# EAGLE schematic H05-dl (EAGLE 6.6.0)

## Sheet 1 of 3
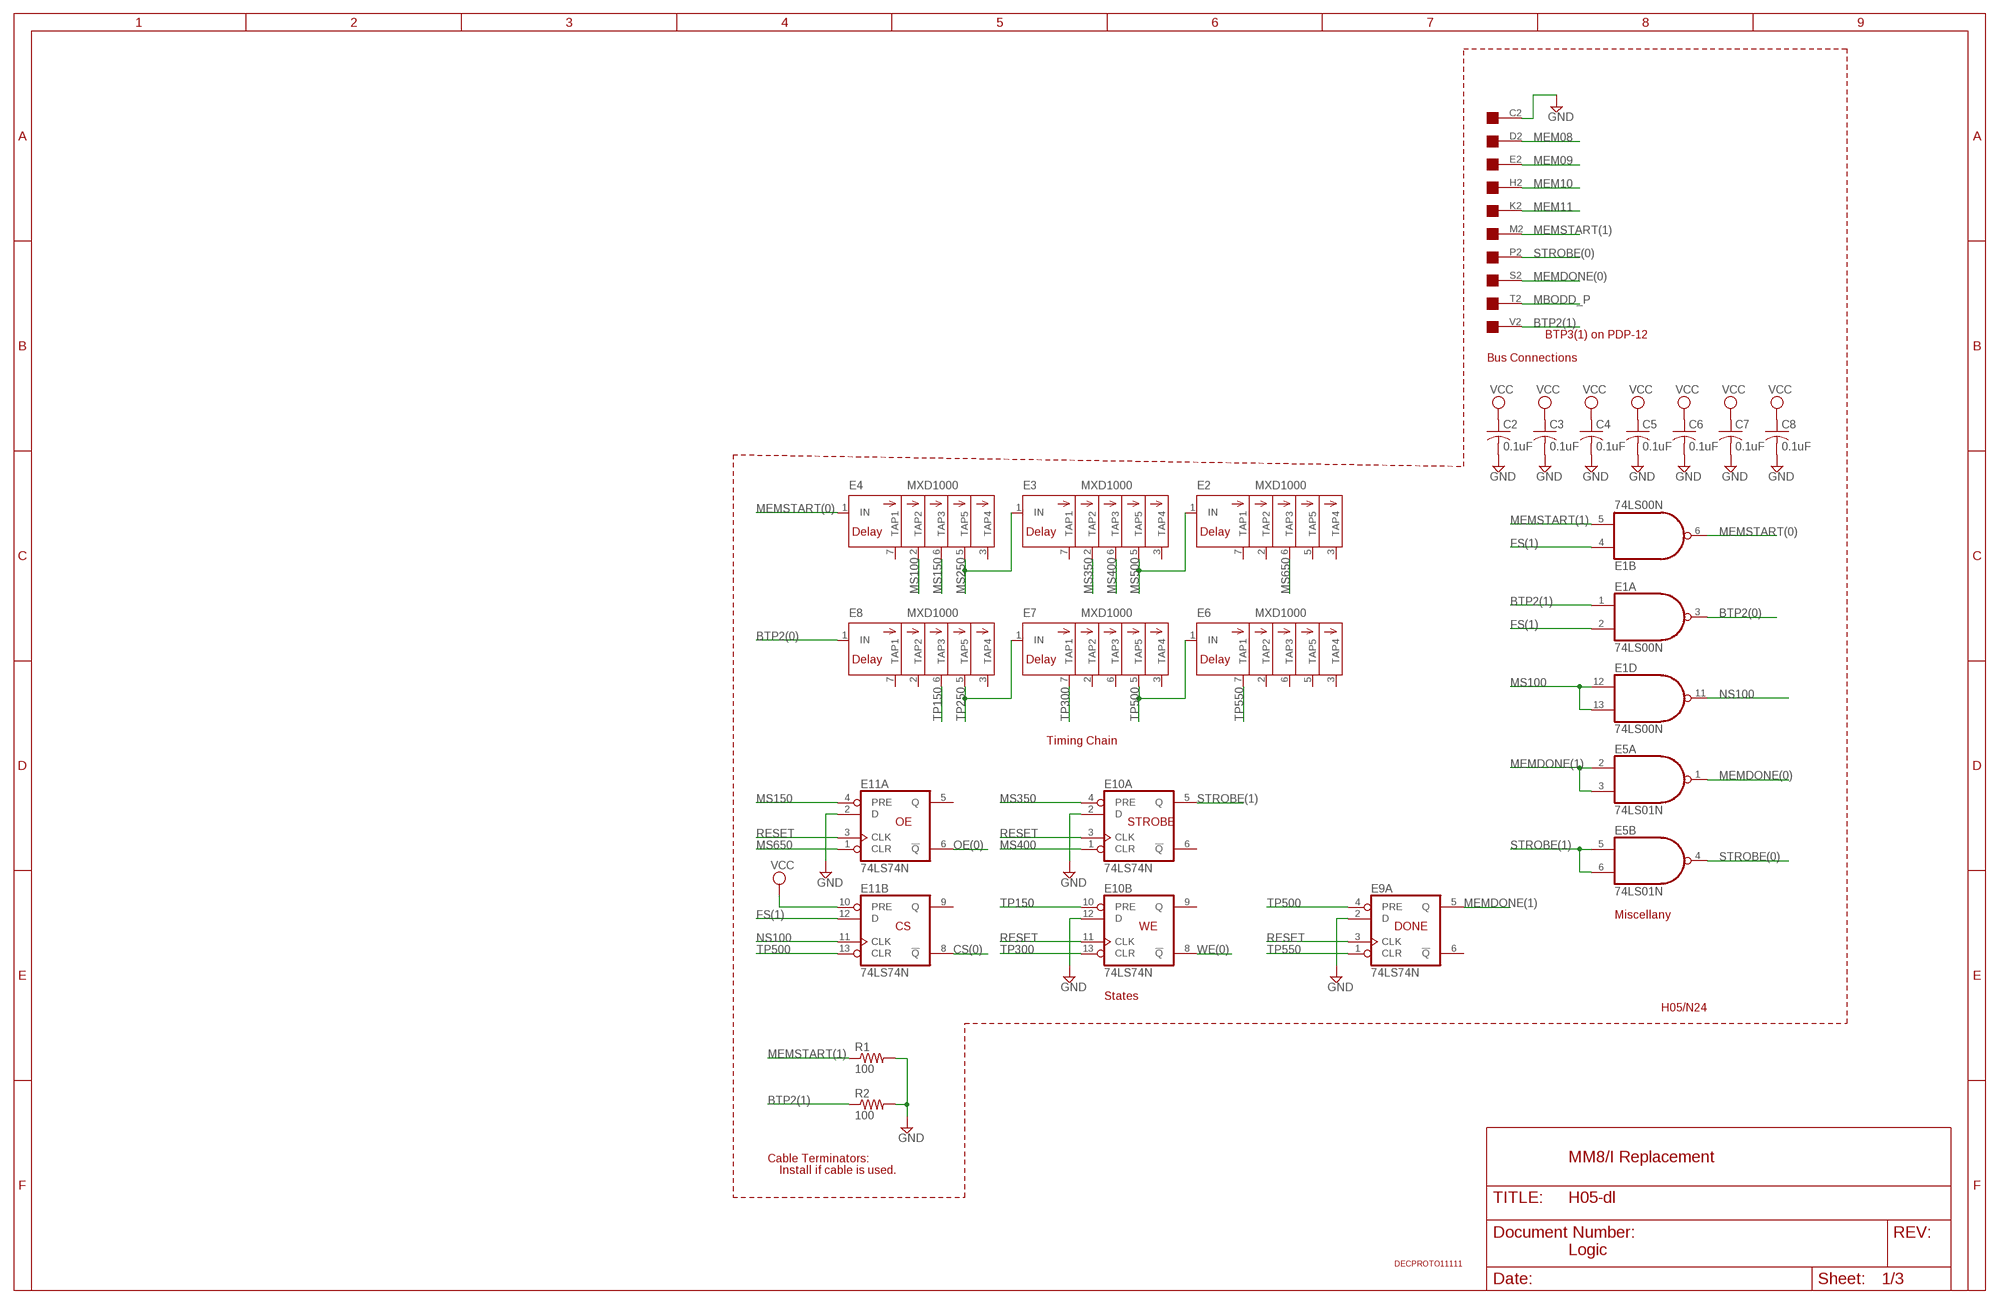
[diagram p0: schematic, sheet 1]

### Parts
C2  0.1uF  C-US050-025X075  [C050-025X075]
C3  0.1uF  C-US050-025X075  [C050-025X075]
C4  0.1uF  C-US050-025X075  [C050-025X075]
C5  0.1uF  C-US050-025X075  [C050-025X075]
C6  0.1uF  C-US050-025X075  [C050-025X075]
C7  0.1uF  C-US050-025X075  [C050-025X075]
C8  0.1uF  C-US050-025X075  [C050-025X075]
E1  74LS00N  [DIL14]
E2  MXD1000  [DIL08]
E3  MXD1000  [DIL08]
E4  MXD1000  [DIL08]
E5  74LS01N  [DIL14]
E6  MXD1000  [DIL08]
E7  MXD1000  [DIL08]
E8  MXD1000  [DIL08]
E9  74LS74N  [DIL14]
E10  74LS74N  [DIL14]
E11  74LS74N  [DIL14]
H05  EDGE-1  [EDGE-CON1]
R1  100  R-US_0207/10  [0207/10]
R2  100  R-US_0207/10  [0207/10]
U$6  DECPROTO11111  [DECPROTO11111]

### Nets
BTP2(0): E1.3(A:O) E8.1(IN)
BTP2(1): E1.1(A:I0) H05.V2 R2.1
CS(0): E11.8(B:!Q) ; also sheet 2
FS(1): E1.2(A:I1) E1.4(B:I0) E11.12(B:D) ; also sheet 2
GND [supply]: C2.2 C3.2 C4.2 C5.2 C6.2 C7.2 C8.2 E9.2(A:D) E10.2(A:D) E10.12(B:D) E11.2(A:D) H05.C2 R1.2 R2.2 ; also sheet 2
MBODD_P: H05.T2 ; also sheet 2
MEM08: H05.D2 ; also sheet 2
MEM09: H05.E2 ; also sheet 2
MEM10: H05.H2 ; also sheet 2
MEM11: H05.K2 ; also sheet 2
MEMDONE(0): E5.1(A:O) H05.S2
MEMDONE(1): E5.2(A:I0) E5.3(A:I1) E9.5(A:Q)
MEMSTART(0): E1.6(B:O) E4.1(IN) ; also sheet 2
MEMSTART(1): E1.5(B:I1) H05.M2 R1.1
MS100: E1.12(D:I0) E1.13(D:I1) E4.2(TAP2)
MS150: E4.6(TAP3) E11.4(A:PRE)
MS250: E3.1(IN) E4.5(TAP5)
MS350: E3.2(TAP2) E10.4(A:PRE)
MS400: E3.6(TAP3) E10.1(A:CLR)
MS500: E2.1(IN) E3.5(TAP5)
MS650: E2.6(TAP3) E11.1(A:CLR)
NS100: E1.11(D:O) E11.11(B:CLK)
OE(0): E11.6(A:!Q) ; also sheet 2
RESET: E9.3(A:CLK) E10.3(A:CLK) E10.11(B:CLK) E11.3(A:CLK) ; also sheet 2
STROBE(0): E5.4(B:O) H05.P2
STROBE(1): E5.5(B:I0) E5.6(B:I1) E10.5(A:Q)
TP150: E8.6(TAP3) E10.10(B:PRE)
TP250: E7.1(IN) E8.5(TAP5)
TP300: E7.7(TAP1) E10.13(B:CLR)
TP500: E6.1(IN) E7.5(TAP5) E9.4(A:PRE) E11.13(B:CLR)
TP550: E6.7(TAP1) E9.1(A:CLR)
VCC [supply]: C2.1 C3.1 C4.1 C5.1 C6.1 C7.1 C8.1 E11.10(B:PRE) ; also sheet 2
WE(0): E10.8(B:!Q) ; also sheet 2
Unconnected: E2.2(TAP2) E2.3(TAP4) E2.5(TAP5) E2.7(TAP1) E3.3(TAP4) E3.7(TAP1) E4.3(TAP4) E4.7(TAP1) E6.2(TAP2) E6.3(TAP4) E6.5(TAP5) E6.6(TAP3) E7.2(TAP2) E7.3(TAP4) E7.6(TAP3) E8.2(TAP2) E8.3(TAP4) E8.7(TAP1) E9.6(A:!Q) E10.6(A:!Q) E10.9(B:Q) E11.5(A:Q) E11.9(B:Q) H05.A2 H05.B2 H05.F2 H05.J2 H05.L2 H05.N2 H05.R2 H05.U2

### Notes on the sheet
- BTP3(1) on PDP-12
- Bus Connections
- Timing Chain
- OE | STROBE
- Miscellany
- CS | WE | DONE
- States
- H05/N24
- Cable Terminators: | MM8/I Replacement
- Install if cable is used.
- Logic

## Sheet 2 of 3
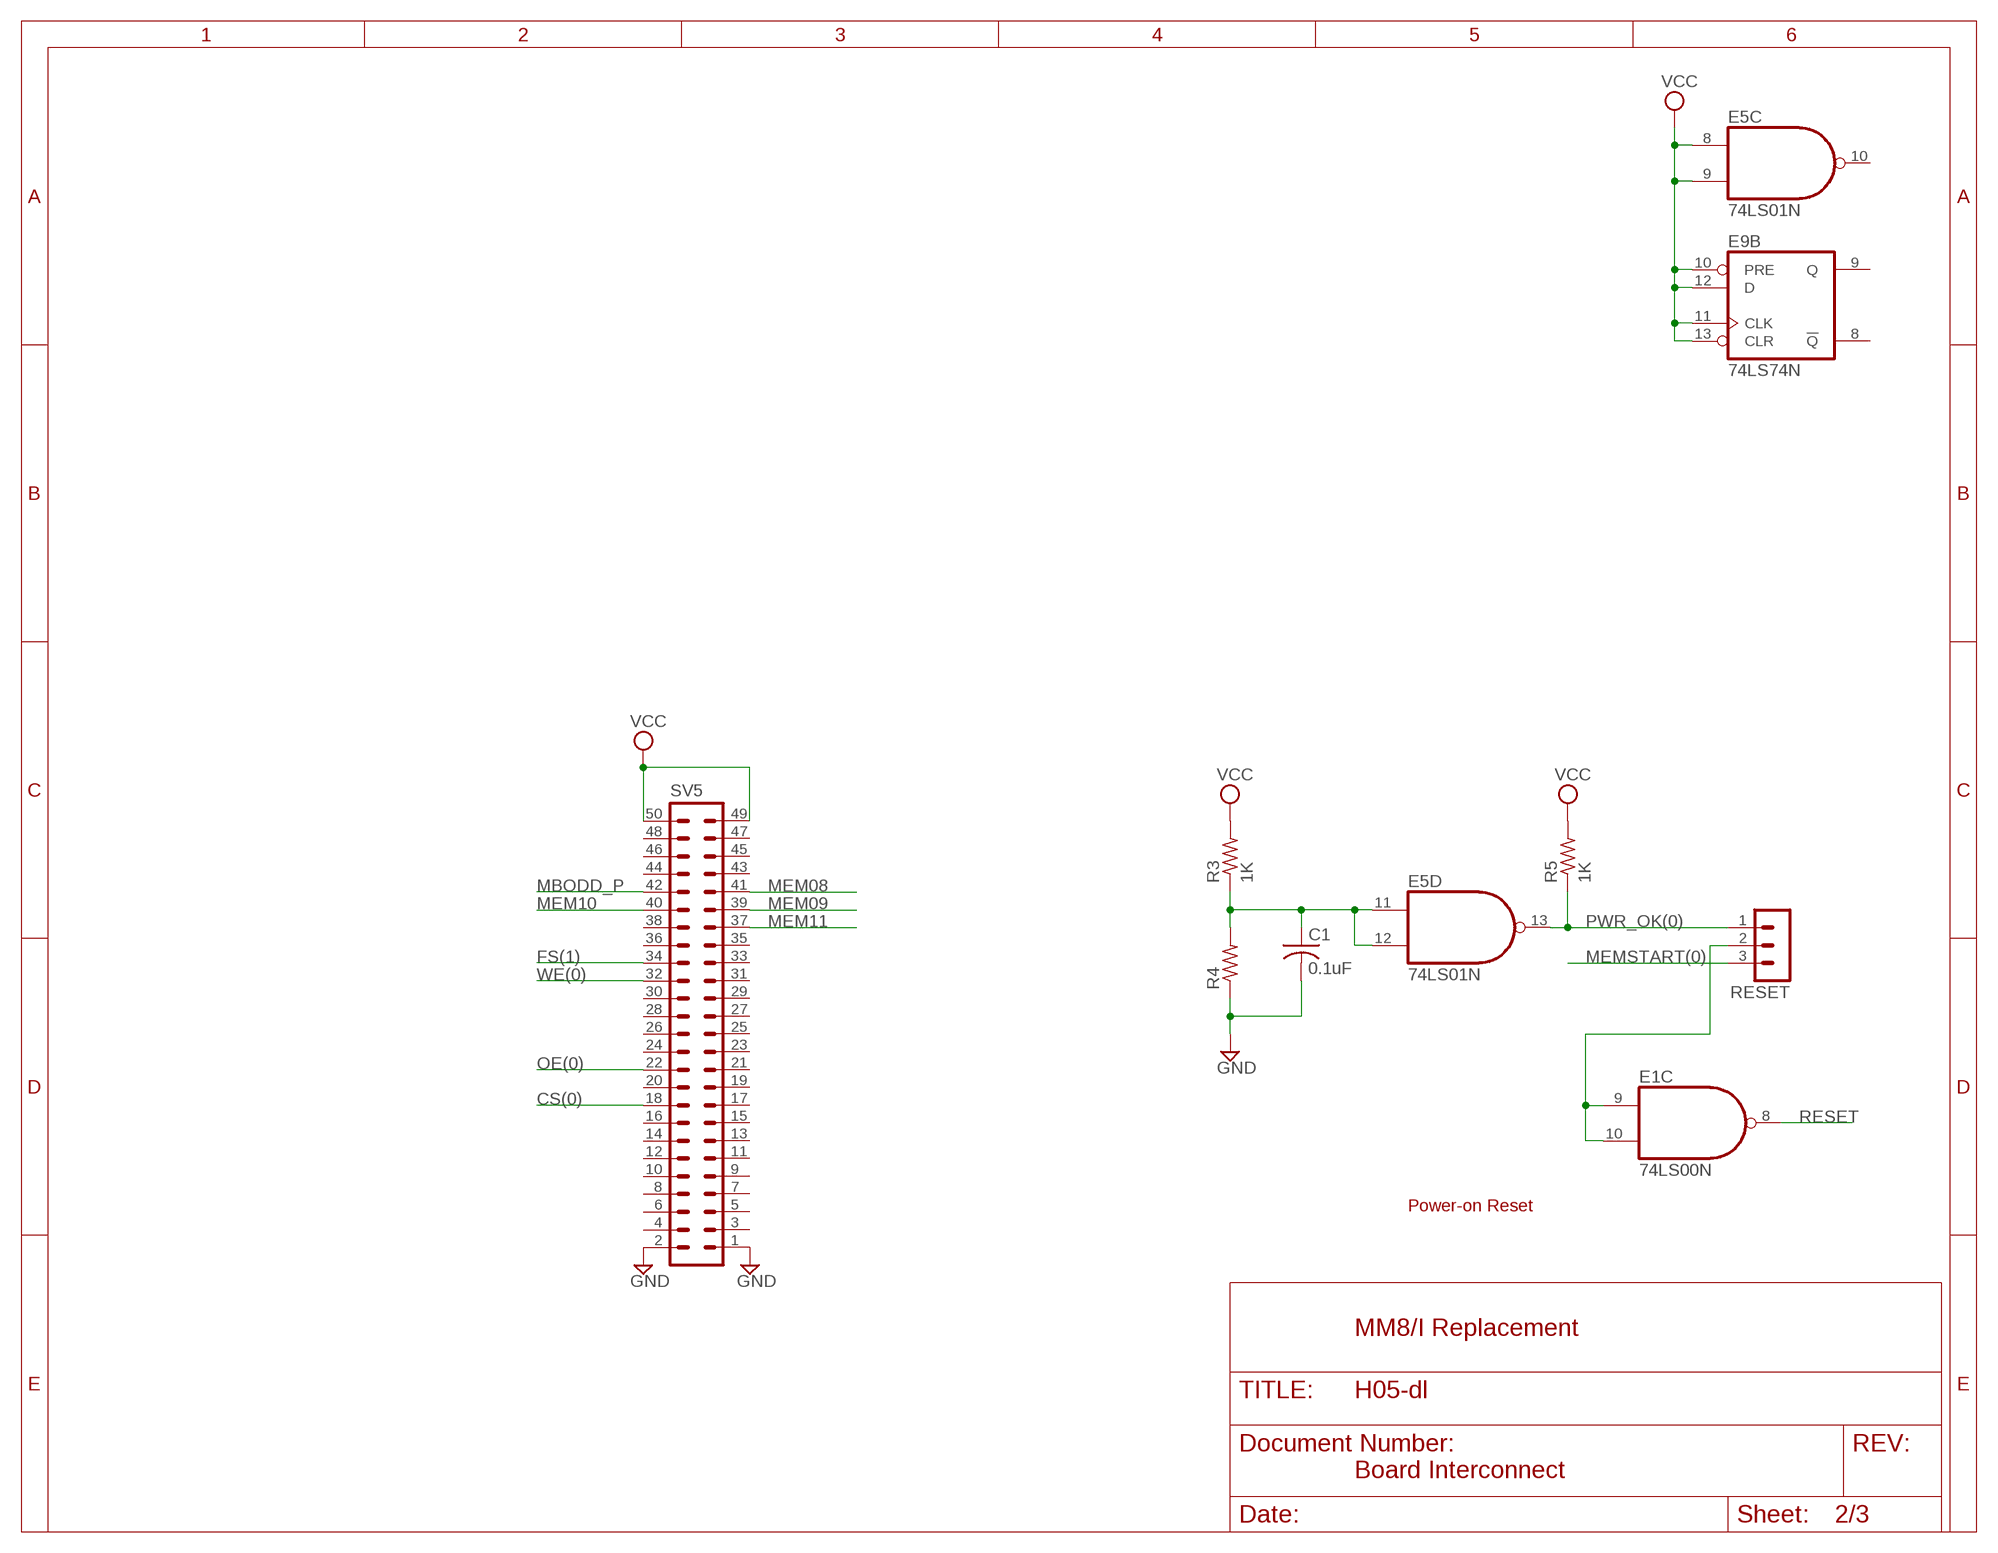
[diagram p1: schematic, sheet 2]

### Parts
C1  0.1uF  C-US050-025X075  [C050-025X075]
R3  1K  R-US_0207/10  [0207/10]
R4  R-US_0207/10  [0207/10]
R5  1K  R-US_0207/10  [0207/10]
RESET  MA03-1  [MA03-1]
SV5  ML50L  [ML50L]

### Nets
CS(0): SV5.18 ; also sheet 1
FS(1): SV5.34 ; also sheet 1
GND [supply]: C1.2 R4.1 SV5.1 SV5.2 ; also sheet 1
MBODD_P: SV5.42 ; also sheet 1
MEM08: SV5.41 ; also sheet 1
MEM09: SV5.39 ; also sheet 1
MEM10: SV5.40 ; also sheet 1
MEM11: SV5.37 ; also sheet 1
MEMSTART(0): RESET.3 ; also sheet 1
N$1: E1.9(C:I0) E1.10(C:I1) RESET.2
OE(0): SV5.22 ; also sheet 1
PWR_OK: C1.1 E5.11(D:I0) E5.12(D:I1) R3.1 R4.2
PWR_OK(0): E5.13(D:O) R5.1 RESET.1
RESET: E1.8(C:O) ; also sheet 1
VCC [supply]: E5.8(C:I0) E5.9(C:I1) E9.10(B:PRE) E9.11(B:CLK) E9.12(B:D) E9.13(B:CLR) R3.2 R5.2 SV5.49 SV5.50 ; also sheet 1
WE(0): SV5.32 ; also sheet 1
Unconnected: E5.10(C:O) E9.8(B:!Q) E9.9(B:Q) SV5.3 SV5.4 SV5.5 SV5.6 SV5.7 SV5.8 SV5.9 SV5.10 SV5.11 SV5.12 SV5.13 SV5.14 SV5.15 SV5.16 SV5.17 SV5.19 SV5.20 SV5.21 SV5.23 SV5.24 SV5.25 SV5.26 SV5.27 SV5.28 SV5.29 SV5.30 SV5.31 SV5.33 SV5.35 SV5.36 SV5.38 SV5.43 SV5.44 SV5.45 SV5.46 SV5.47 SV5.48

### Notes on the sheet
- Power-on Reset
- MM8/I Replacement
- Board Interconnect

## Sheet 3 of 3
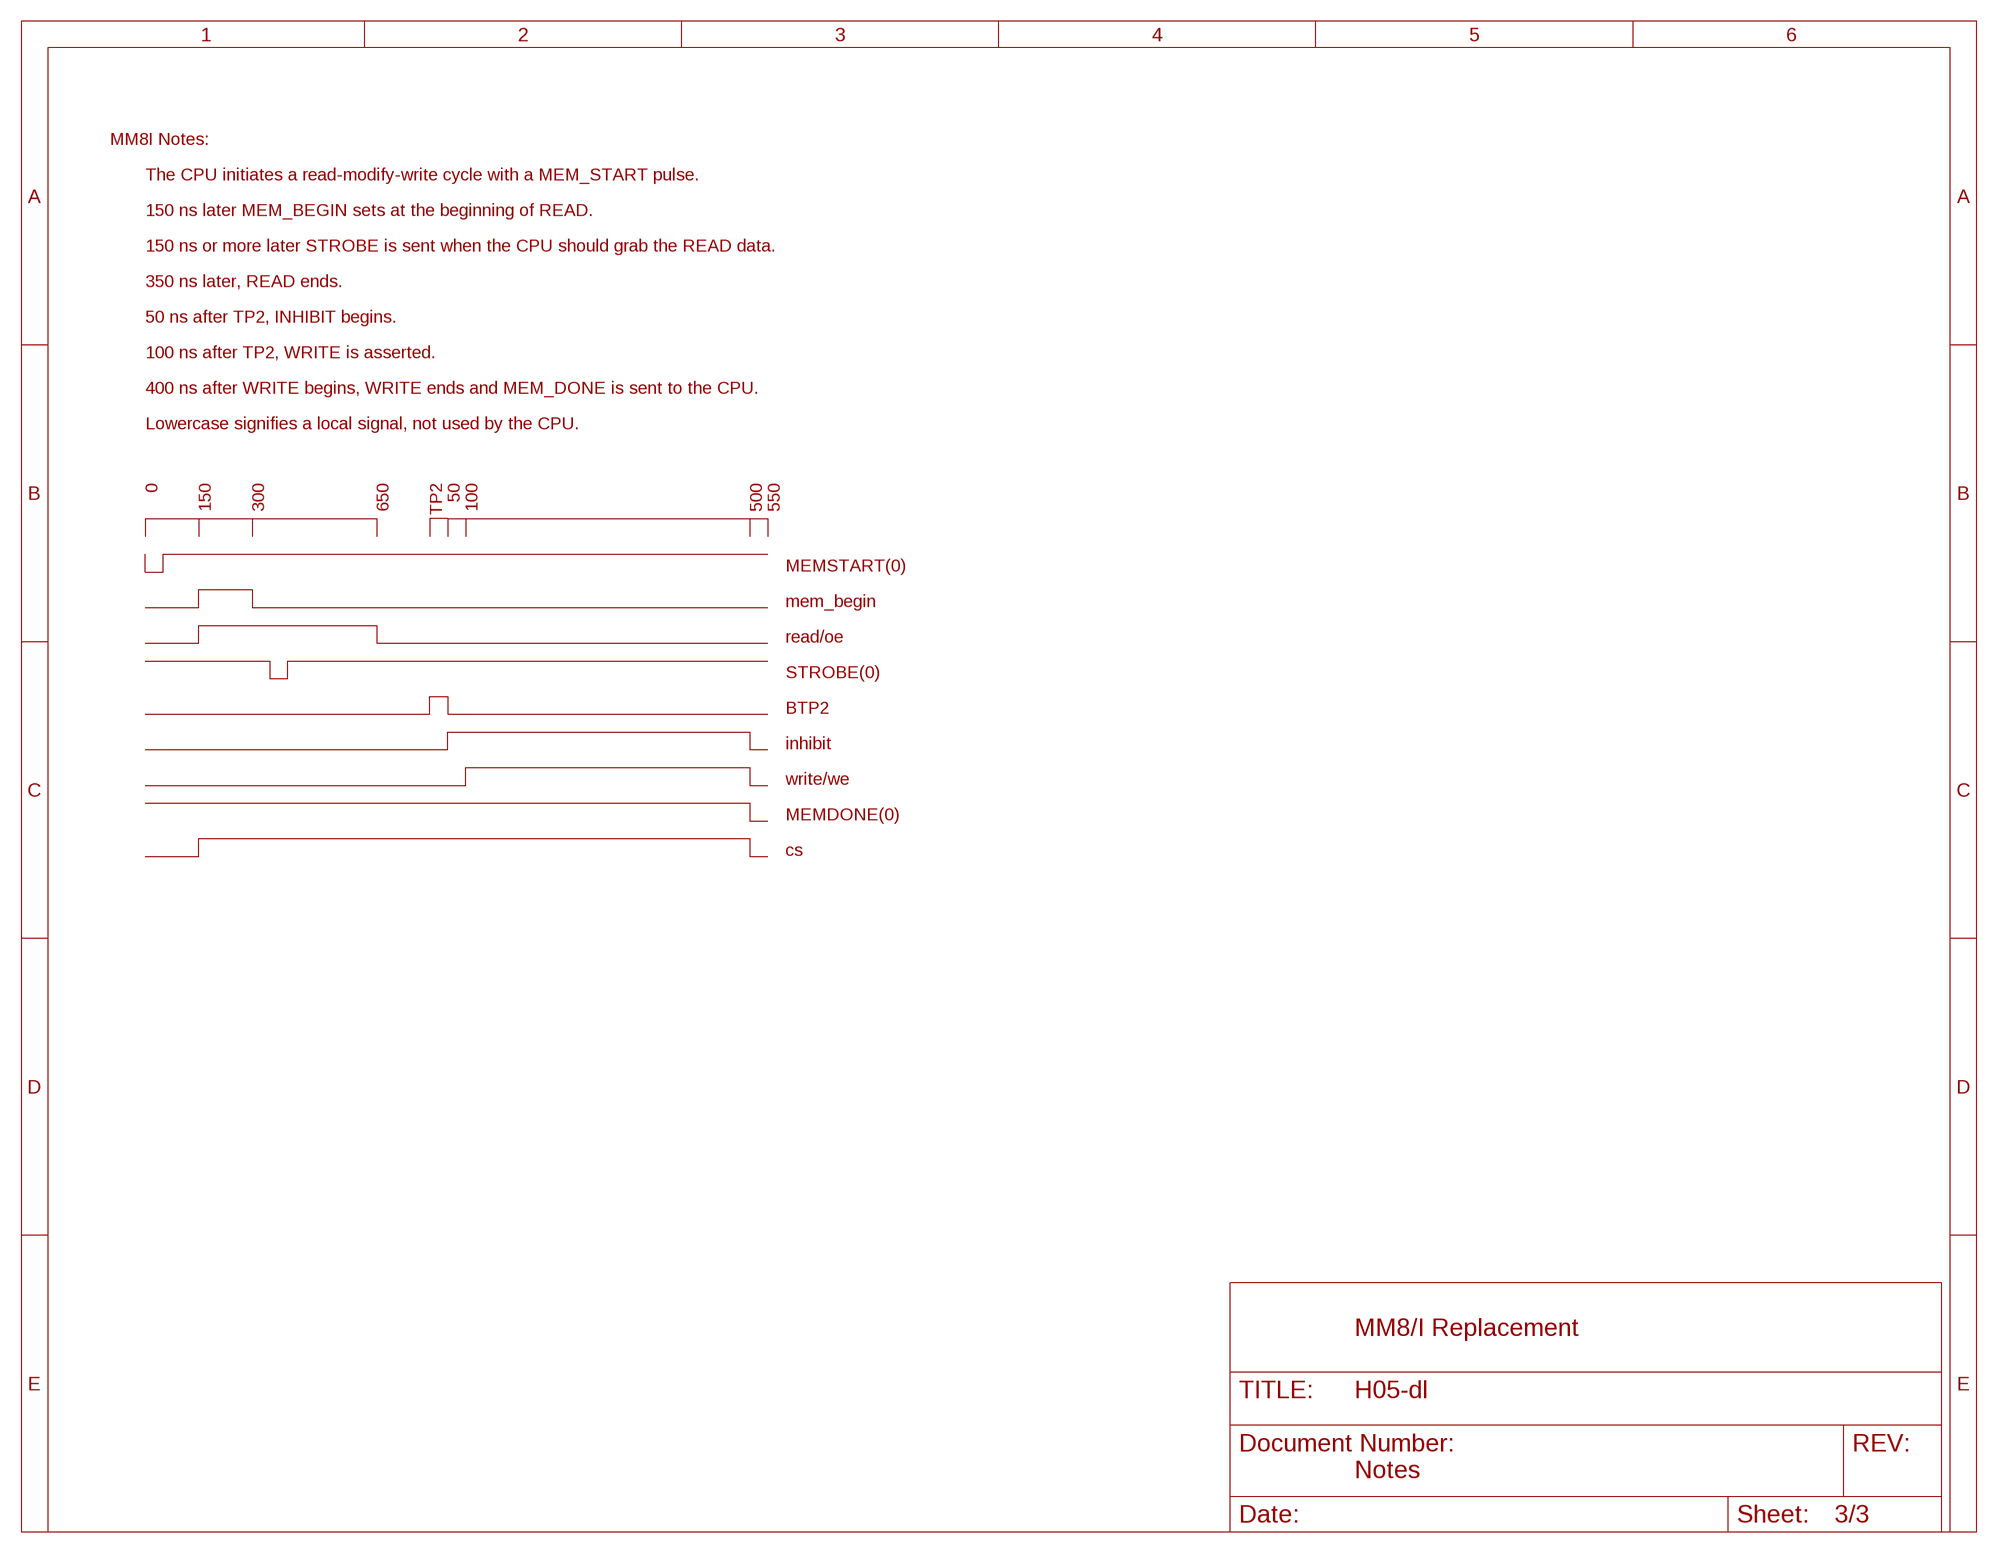
[diagram p2: schematic, sheet 3]

### Notes on the sheet
- MM8I Notes:
- The CPU initiates a read-modify-write cycle with a MEM_START pulse.
- 150 ns later MEM_BEGIN sets at the beginning of READ.
- 150 ns or more later STROBE is sent when the CPU should grab the READ data.
- 350 ns later, READ ends.
- 50 ns after TP2, INHIBIT begins.
- 100 ns after TP2, WRITE is asserted.
- 400 ns after WRITE begins, WRITE ends and MEM_DONE is sent to the CPU.
- Lowercase signifies a local signal, not used by the CPU.
- 0 | 150 | 300 | 650 | TP2 | 50 | 100 | 500 | 550
- MEMSTART(0)
- mem_begin
- read/oe
- STROBE(0)
- BTP2
- inhibit
- write/we
- MEMDONE(0)
- cs
- MM8/I Replacement
- Notes

## Power pins joined to a net without a drawn wire
GND: E1.7(P:GND) E2.4(GND) E3.4(GND) E4.4(GND) E5.7(P:GND) E6.4(GND) E7.4(GND) E8.4(GND) E9.7(P:GND) E10.7(P:GND) E11.7(P:GND)
VCC: E1.14(P:VCC) E2.8(VCC) E3.8(VCC) E4.8(VCC) E5.14(P:VCC) E6.8(VCC) E7.8(VCC) E8.8(VCC) E9.14(P:VCC) E10.14(P:VCC) E11.14(P:VCC)

## Library data of the parts
C1-C8 = rcl:C-US: CAPACITOR, American symbol
E1 = 74xx-us:74*00: Quad 2-input NAND gate
E2-E4 E6-E8 = maxim:MXD1000: DELAY LINE; OC_FARNELL: unknown; OC_NEWARK: unknown
E5 = 74xx-us:74*01: Quad 2-input NAND gate, open collector
E9-E11 = 74xx-us:74*74: Dual D type positive edge triggered FLIP FLOP, preset and clear
H05 = dec-con:EDGE-1: Single-Sided DEC Edge Connector -- (side 2)
R1-R5 = rcl:R-US_: RESISTOR, American symbol
RESET = con-lstb:MA03-1: PIN HEADER; OC_FARNELL: unknown; OC_NEWARK: unknown
SV5 = con-ml:ML50L: HARTING; OC_FARNELL: unknown; OC_NEWARK: unknown
U$6 = dec-con:DECPROTO: Various small DEC boards stuck together with break-away tab routing.

## Net classes
1 supply: width 0.711 mm